# Altium project ECE453_DumptruckUltra_Board.PrjPcb (part 1 of 4)
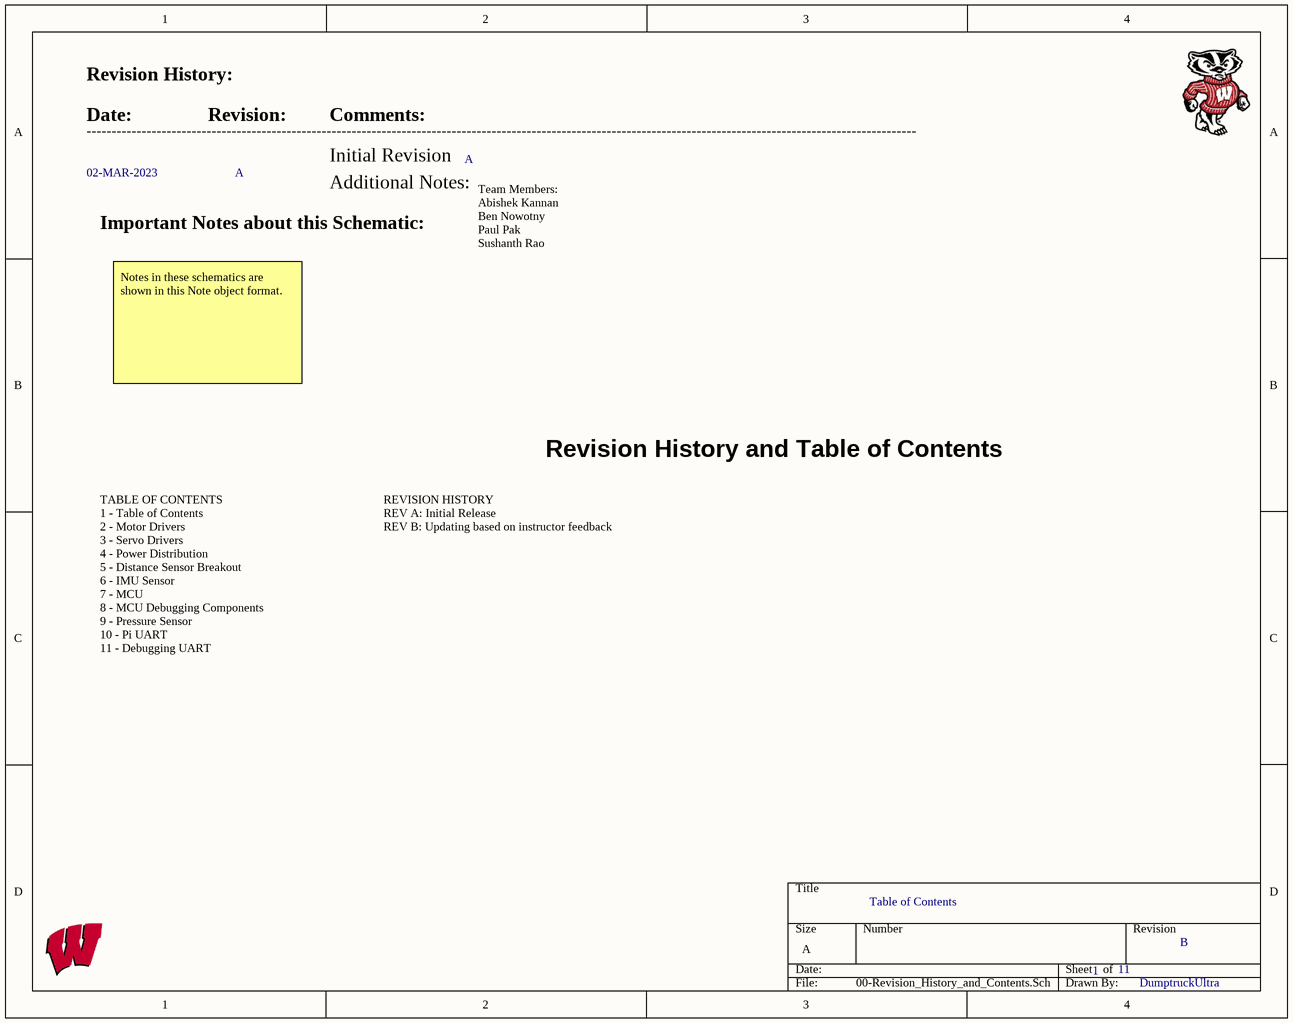
[diagram p0: 00-Revision_History_and_Contents.SchDoc]
11 sheets, 232 parts. Net scope: global (net labels, ports and power ports of the same name join across sheets).
Board file: MainBoard.PcbDoc
Sheets:
  00-Revision_History_and_Contents.SchDoc
  MotorDrivers.SchDoc
  ServoDrivers.SchDoc
  PowerDistribution.SchDoc
  DistanceSensor.SchDoc
  IMU.SchDoc
  MCU.SchDoc
  MCUDebug.SchDoc
  PressureSensor.SchDoc
  UART.SchDoc
  USB_to_UART.SchDoc

## Sheet 00-Revision_History_and_Contents.SchDoc: Revision History and Contents
size A; Date: 4/25/2017; ApprovedBy: JSK; CheckedBy: JSK; Author: JSK; CompanyName: University of Wisconsin; DrawnBy: JSK; Engineer: JSK; Organization: ECE 315; Address1: College of Engineering; Address2: 1415 Engineering Drive; Address3: Madison, WI 53706; Address4: ECE 453 Spring 2017; Revision: A; SheetNumber: 1; SheetTotal: 11

### Notes on the sheet
- Revision History:
- Date:
- ----------------------------------------------------------------------------------------------------------------------------------------------------------------------
- Revision:
- Comments:
- Initial Revision
- A
- 02-MAR-2023
- Important Notes about this Schematic:
- Additional Notes:
- Team Members:
  Abishek Kannan
  Ben Nowotny
  Paul Pak
  Sushanth Rao
- Notes in these schematics are shown in this Note object format.
- Revision History and Table of Contents
- TABLE OF CONTENTS
  1 - Table of Contents
  2 - Motor Drivers
  3 - Servo Drivers
  4 - Power Distribution
  5 - Distance Sensor Breakout
  6 - IMU Sensor
  7 - MCU
  8 - MCU Debugging Components
  9 - Pressure Sensor
  10 - Pi UART
  11 - Debugging UART
- REVISION HISTORY
  REV A: Initial Release
  REV B: Updating based on instructor feedback
- Table of Contents
- 1
- 11
- B
- DumptruckUltra

## Sheet MotorDrivers.SchDoc
size A; SheetNumber: 2; SheetTotal: 11
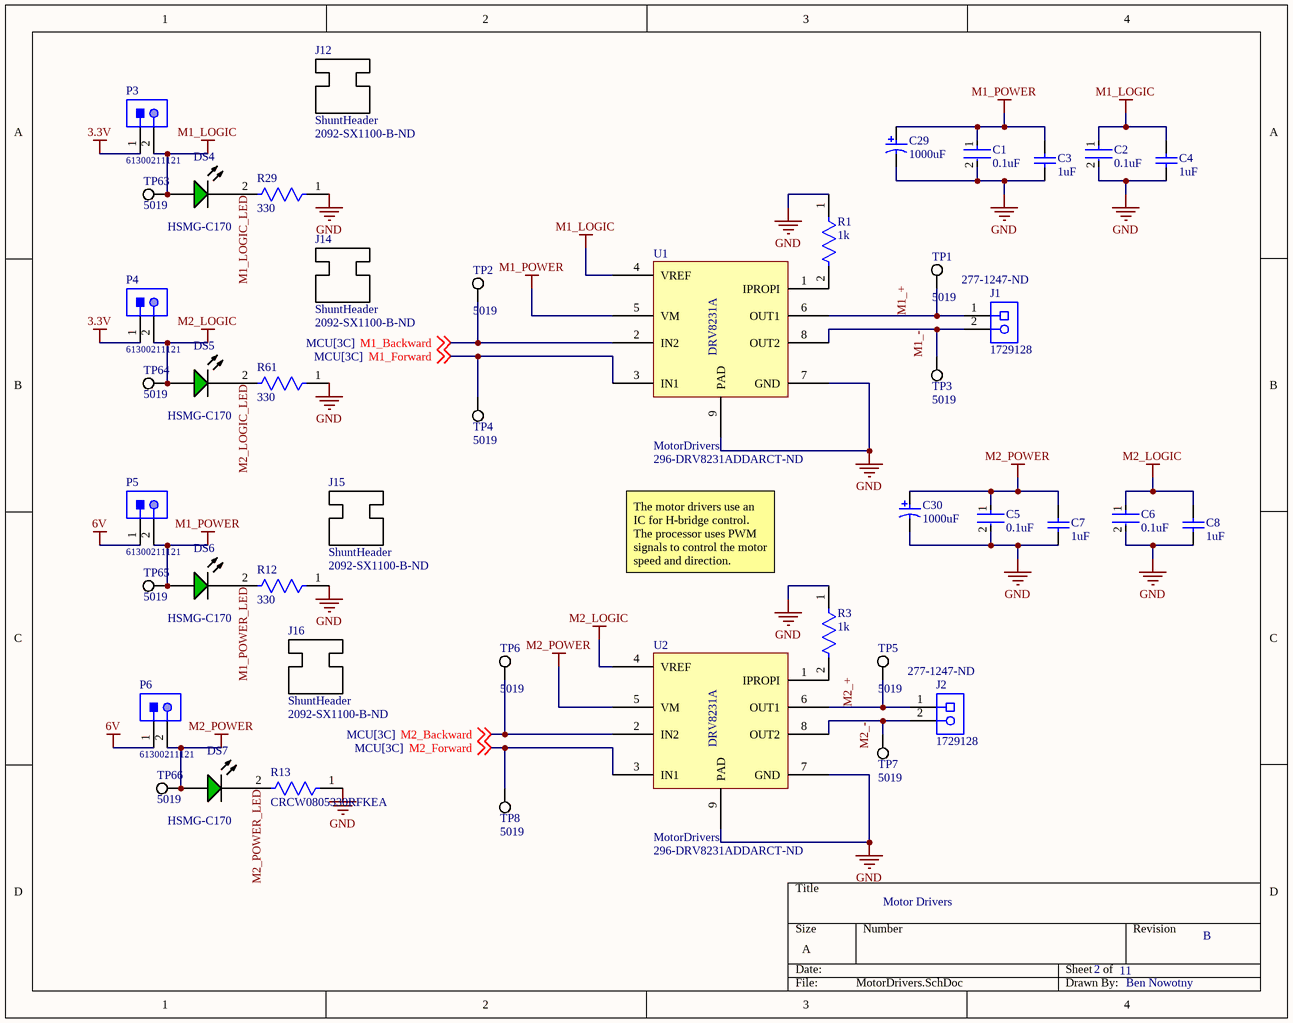
[diagram p1: MotorDrivers.SchDoc]

### Parts
C1  0.1uF  [FP-CC0805-0_85-MFG]
C2  0.1uF  [FP-CC0805-0_85-MFG]
C3  1uF  [CAPC2013X145X50ML20T25]
C4  1uF  [CAPC2013X145X50ML20T25]
C5  0.1uF  [FP-CC0805-0_85-MFG]
C6  0.1uF  [FP-CC0805-0_85-MFG]
C7  1uF  [CAPC2013X145X50ML20T25]
C8  1uF  [CAPC2013X145X50ML20T25]
C29  1000uF  [NIC-CAPA2-10X10_V]
C30  1000uF  [NIC-CAPA2-10X10_V]
DS4  HSMG-C170  [AVAG-HSMX-C170_V]
DS5  HSMG-C170  [AVAG-HSMX-C170_V]
DS6  HSMG-C170  [AVAG-HSMX-C170_V]
DS7  HSMG-C170  [AVAG-HSMX-C170_V]
J1  1729128  Supplier Part Number 1: 277-1247-ND  [PHOE-1729128-2_V]
J2  1729128  Supplier Part Number 1: 277-1247-ND  [PHOE-1729128-2_V]
J12  ShuntHeader  Supplier Part Number 1: 2092-SX1100-B-ND
J14  ShuntHeader  Supplier Part Number 1: 2092-SX1100-B-ND
J15  ShuntHeader  Supplier Part Number 1: 2092-SX1100-B-ND
J16  ShuntHeader  Supplier Part Number 1: 2092-SX1100-B-ND
P3  61300211121  [61300211121]
P4  61300211121  [61300211121]
P5  61300211121  [61300211121]
P6  61300211121  [61300211121]
R1  1k  [FP-ERA6A-IPC_C]
R3  1k  [FP-ERA6A-IPC_C]
R12  330  [FP-CRCW0805-e3-MFG]
R13  CRCW0805330RFKEA  [FP-CRCW0805-e3-MFG]
R29  330  [FP-CRCW0805-e3-MFG]
R61  330  [FP-CRCW0805-e3-MFG]
TP1  5019  [KSTN-5019_V]
TP2  5019  [KSTN-5019_V]
TP3  5019  [KSTN-5019_V]
TP4  5019  [KSTN-5019_V]
TP5  5019  [KSTN-5019_V]
TP6  5019  [KSTN-5019_V]
TP7  5019  [KSTN-5019_V]
TP8  5019  [KSTN-5019_V]
TP63  5019  [KSTN-5019_V]
TP64  5019  [KSTN-5019_V]
TP65  5019  [KSTN-5019_V]
TP66  5019  [KSTN-5019_V]
U1  MotorDrivers  Supplier Part Number 1: 296-DRV8231ADDARCT-ND  [SOIC127P600X170_HS-9N]
U2  MotorDrivers  Supplier Part Number 1: 296-DRV8231ADDARCT-ND  [SOIC127P600X170_HS-9N]

### Nets
3.3V: P3.1 P4.1  [project net RGBLED_R]
6V: P5.1 P6.1
GND: C1.2 C2.2 C3.1 C4.1 C5.2 C6.2 C7.1 C8.1 C29.2 C30.2 R1.1 R3.1 R12.1 R13.1 R29.1 R61.1 U1.7(GND) U1.9(PAD) U2.7(GND) U2.9(PAD)
M1_LOGIC: C2.1 C4.2 DS4.1(A) P3.2 TP63.1 U1.4(VREF)
M1_POWER: C1.1 C3.2 C29.1 DS6.1(A) P5.2 TP65.1 U1.5(VM)
M2_LOGIC: C6.1 C8.2 DS5.1(A) P4.2 TP64.1 U2.4(VREF)
M2_POWER: C5.1 C7.2 C30.1 DS7.1(A) P6.2 TP66.1 U2.5(VM)
M1_+: J1.1 TP1.1 U1.6(OUT1)
M1_-: J1.2 TP3.1 U1.8(OUT2)
M1_Backward: TP2.1 U1.2(IN2) ; off-sheet M1_Backward
M1_Forward: TP4.1 U1.3(IN1) ; off-sheet M1_Forward
M1_LOGIC_LED: DS4.2(K) R29.2
M1_POWER_LED: DS6.2(K) R12.2
M2_+: J2.1 TP5.1 U2.6(OUT1)
M2_-: J2.2 TP7.1 U2.8(OUT2)
M2_Backward: TP6.1 U2.2(IN2) ; off-sheet M2_Backward
M2_Forward: TP8.1 U2.3(IN1) ; off-sheet M2_Forward
M2_LOGIC_LED: DS5.2(K) R61.2
M2_POWER_LED: DS7.2(K) R13.2
NetR1_2: R1.2 U1.1(IPROPI)
NetR3_2: R3.2 U2.1(IPROPI)

### Notes on the sheet
- The motor drivers use an IC for H-bridge control.  The processor uses PWM signals to control the motor speed and direction.
- Motor Drivers
- 11
- B
- Ben Nowotny
- (in symbol MotorDrivers) DRV8231A

### Library data of the parts
C1 C2 C5 C6 = CMP-1036-04410-2: CAP CER 0.1UF 25V X7R 0805; Manufacturer Part Number: CC0805KRX7R8BB104; Manufacturer: Yageo; Tolerance: 0.1; Material: Ceramic; Value: 100 nF; Insulation Resistance: 100GR; ComponentLink2URL: http://www.yageo.com/documents/recent/UPY-GPHC_Y5V_6.3V-to-50V_8.pdf; Category: Cap; Mouser Description: Multilayer Ceramic Capacitors MLCC - SMD/SMT 100nF 25V X7R 10%; Device Class L1: Passive Components; Footprint Url: http://www.yageo.com/exep/pages/download/literatures/UPY-C_GEN_24.pdf; Height: 0.95mm; Digikey Description: CAP CER 0.1UF 25V X7R 0805; Lead Free: Yes; Temperature Range High: +85°C; Temperature: -30°C to +85°C; Ipc Land Pattern Name: CAPC200125X85; Capacitance: 100 nF; Automotive: No; Octopart: https://octopart.com/cc0805krx7r8bb104-yageo-39467766; Device Class L2: Capacitors; Temperature Characteristic: X7R; Voltage Rating: 25 V; ComponentLink2Description: Datasheet; Temperature Range Low: -30°C; Device Class L3: Ceramic Capacitors; RoHS: TRUE; Package: CC0805-0.85; Supplier 1: Digi-Key; Supplier Part Number 1: 311-1141-1-ND; Stock 1: 1013369; Pricing 1: 1=0.11000, 10=0.07700, 50=0.04380, 100=0.03620, 500=0.02542, 1000=0.02104 (USD); Mount: Surface Mount; Case/Package: 0805; Number of Pins: 2; Case Code (Metric): 2012; Case Code (Imperial): 0805; Min Operating Temperature: -55°C; Max Operating Temperature: 125°C; Packaging: Tape and Reel; Voltage Rating (DC): 25V; Dielectric: X7R; Package Quantity: 4000; Termination: SMD/SMT; Series: CC; Resistor Type: Ceramic; Length: 2mm; Width: 1.25mm; Depth: 1.25mm; Thickness: 0.033inch; Radiation Hardening: No; RoHS Compliant: Yes; Reach SVHC Compliant: Yes; Halogen Free: Halogen Free; ComponentLink1URL: https://datasheet.ciiva.com/8034/70765-8034031.pdf?src-supplier=Element14; ComponentLink1Description: https://datasheet.ciiva.com/8034/70765-8034031.pdf?src-supplier=Element14; ComponentLink3URL: https://datasheet.ciiva.com/28450/1489800-28450789.pdf?src-supplier=Element14; ComponentLink3Description: https://datasheet.ciiva.com/28450/1489800-28450789.pdf?src-supplier=Element14; ComponentLink4URL: https://datasheet.ciiva.com/46430/1850775-46430166.pdf?src-supplier=Element14; ComponentLink4Description: https://datasheet.ciiva.com/46430/1850775-46430166.pdf?src-supplier=Element14; ComponentLink5URL: https://datasheet.ciiva.com/145/mlccorderingcode-145008.pdf?src-supplier=Digi-Key; ComponentLink5Description: https://datasheet.ciiva.com/145/mlccorderingcode-145008.pdf?src-supplier=Digi-Key; ComponentLink6URL: https://datasheet.ciiva.com/145/mlccorderingcode-145007.pdf?src-supplier=Digi-Key; ComponentLink6Description: https://datasheet.ciiva.com/145/mlccorderingcode-145007.pdf?src-supplier=Digi-Key; ComponentLink7URL: https://datasheet.ciiva.com/145/mlccorderingcode-145009.pdf?src-supplier=Digi-Key; ComponentLink7Description: https://datasheet.ciiva.com/145/mlccorderingcode-145009.pdf?src-supplier=Digi-Key; ComponentLink8URL: https://datasheet.ciiva.com/8034/1784427-8034030.pdf?src-supplier=Element14; ComponentLink8Description: https://datasheet.ciiva.com/8034/1784427-8034030.pdf?src-supplier=Element14
C3 C4 C7 C8 = CMP-1036-04757-2: Part Number: CC0805ZRY5V8BB105; Manufacturer: Yageo; Voltage Rating: 25V; Tolerance: 80%; Dielectric: Y5V; Supplier 1: Digi-Key; Supplier Part Number 1: 311-1358-1-ND; Manufacturer Part Number: CC0805ZRY5V8BB105; RoHS: Yes; Category: Ceramic Capacitors; Stock 1: 286163; Pricing 1: 1=0.13000, 10=0.09000, 50=0.05100, 100=0.04230, 500=0.02966, 1000=0.02456 (USD); Mount: Surface Mount; Case/Package: 0805; Case Code (Metric): 2012; Case Code (Imperial): 0805; Weight: 0.000194oz; Min Operating Temperature: -30°C; Max Operating Temperature: 85°C; Package Quantity: 1; Capacitance: 1uF; Packaging: Tape and Reel; Voltage Rating (DC): 25V; Termination: SMD/SMT; Series: CC; Resistor Type: Ceramic; Length: 2mm; Width: 1.25mm; Height: 0.85mm; Thickness: 0.033inch; Depth: 1.25mm; Radiation Hardening: No; RoHS Compliant: Yes; Reach SVHC Compliant: Yes; Lead Free: Lead Free; Halogen Free: Halogen Free; ComponentLink1URL: https://datasheet.ciiva.com/144/mlccorderingcode-144703.pdf?src-supplier=Digi-Key; ComponentLink1Description: https://datasheet.ciiva.com/144/mlccorderingcode-144703.pdf?src-supplier=Digi-Key; ComponentLink2URL: https://datasheet.ciiva.com/26863/getdatasheetpartid-419810-26863011.pdf?src-supplier=Verical; ComponentLink2Description: https://datasheet.ciiva.com/26863/getdatasheetpartid-419810-26863011.pdf?src-supplier=Verical; ComponentLink3URL: https://datasheet.ciiva.com/28450/1132289-28450860.pdf?src-supplier=Element14; ComponentLink3Description: https://datasheet.ciiva.com/28450/1132289-28450860.pdf?src-supplier=Element14; ComponentLink4URL: https://datasheet.ciiva.com/144/mlccorderingcode-144704.pdf?src-supplier=Digi-Key; ComponentLink4Description: https://datasheet.ciiva.com/144/mlccorderingcode-144704.pdf?src-supplier=Digi-Key; ComponentLink5URL: https://datasheet.ciiva.com/144/mlccorderingcode-144705.pdf?src-supplier=Digi-Key; ComponentLink5Description: https://datasheet.ciiva.com/144/mlccorderingcode-144705.pdf?src-supplier=Digi-Key; ComponentLink6URL: https://datasheet.ciiva.com/13208/upy-gp-np0-16v-to-50v-8-13208251.pdf?src-supplier=Mouser; ComponentLink6Description: https://datasheet.ciiva.com/13208/upy-gp-np0-16v-to-50v-8-13208251.pdf?src-supplier=Mouser
C29 C30 = CMP-0687-00006-1: Aluminum Electrolytic Capacitor, UD Series, Low Impedance, 1000 uF, 10 V, + / - 20%, -55 to 105 degC, Chip Type, 10 x 10 mm D x L, Pb-Free, Reel; Manufacturer: Nichicon; PartNumber: UUD1A102MNL1GS; Rated Voltage: 10 V; Endurance Time: 5000 h; Impedance: 0.09 Ohm; Packing: Dia382mm Reel; Tolerance Rated Capacitance: -20 to 20%; Rated Ripple Current (at 100kHz): 670 mA; Dielectric Material: Aluminium; Voltage Rating (DC): 10V; Value: 1mF; Ripple Current: 670mA; Leakage Current: 3uA; Life (Hours): 5000Hour; Dissipation Factor: 0.24%; Lead Diameter: 1.1mm; DatasheetVersion: 08/2012; PackageReference: CAPAE-D10H10; PackageDescription: 2-Pin Surface Mount Device, Diameter 10 mm, Height 10 mm, Pitch 8 mm; ComponentLink3URL: http://products.nichicon.co.jp/en/pdf/XJA043/e-ud.pdf; ComponentLink2Description: Datasheet; Diameter: 10 mm; ComponentLink1Description: Manufacturer URL; RoHS: TRUE; ComponentLink2URL: http://products.nichicon.co.jp/en/pdf/XJA043/e-ud.pdf; Length: 10 mm; Rated Capacitance: 1000 uF; ComponentLink1URL: http://www.nichicon.co.jp/; Mounting Technology: Surface Mount; ComponentLink3Description: Package Specification; Supplier 1: Digi-Key; Supplier Part Number 1: 493-2254-1-ND; Manufacturer Part Number: UUD1A102MNL1GS; Category: Aluminum Electrolytic Capacitors; Stock 1: 3265; Pricing 1: 1=0.94000, 10=0.69100, 50=0.55260, 100=0.47360 (USD); Case/Package: Radial; Pins: 2; Min Operating Temperature: -55°C; Max Operating Temperature: 105°C; Tolerance: 20%; Package Quantity: 1; Packaging: Tape and Reel; Voltage Rating: 10V; Termination: SMD/SMT; Voltage: 10V; Series: UD; Construction: Cylindrical; Ripple Current (AC): 670mA; Height: 10mm; Height - Seated (Max): 0.394inch; Lead Pitch: 4.5mm; Radiation Hardening: No; Reach SVHC Compliant: Yes; RoHS Compliant: Yes; Lead Free: Lead Free; ComponentLink4URL: https://datasheet.ciiva.com/11781/0900766b80fa39e7-11781903.pdf?src-supplier=Rs; ComponentLink4Description: https://datasheet.ciiva.com/11781/0900766b80fa39e7-11781903.pdf?src-supplier=Rs; ComponentLink5URL: https://datasheet.ciiva.com/98/e-ud-98263.pdf?src-supplier=Digi-Key; ComponentLink5Description: https://datasheet.ciiva.com/98/e-ud-98263.pdf?src-supplier=Digi-Key; ComponentLink6URL: https://datasheet.ciiva.com/98/e-ud-98264.pdf?src-supplier=Digi-Key; ComponentLink6Description: https://datasheet.ciiva.com/98/e-ud-98264.pdf?src-supplier=Digi-Key; ComponentLink7URL: https://datasheet.ciiva.com/98/e-ud-98265.pdf?src-supplier=Digi-Key; ComponentLink7Description: https://datasheet.ciiva.com/98/e-ud-98265.pdf?src-supplier=Digi-Key; ComponentLink8URL: https://datasheet.ciiva.com/16502/e-ud-16502759.pdf?src-supplier=Future+Electronics; ComponentLink8Description: https://datasheet.ciiva.com/16502/e-ud-16502759.pdf?src-supplier=Future+Electronics; ComponentLink9URL: https://datasheet.ciiva.com/7793/66055-7793131.pdf?src-supplier=Element14; ComponentLink9Description: https://datasheet.ciiva.com/7793/66055-7793131.pdf?src-supplier=Element14; ComponentLink10URL: https://datasheet.ciiva.com/28458/e-ud-28458024.pdf?src-supplier=Element14; ComponentLink10Description: https://datasheet.ciiva.com/28458/e-ud-28458024.pdf?src-supplier=Element14; ComponentLink11URL: https://datasheet.ciiva.com/22693/66055-22693549.pdf?src-supplier=Element14; ComponentLink11Description: https://datasheet.ciiva.com/22693/66055-22693549.pdf?src-supplier=Element14
DS4-DS7 = CMP-2000-05062-1: Chip LED, Green, 2.2 V, -40 to 85 degC, 2-Pin SMD, Pb-Free, Tape and Reel; Manufacturer: Avago; No. of Pins: 2; Peak Wavelength: 570nm; SVHC: NoSVHC(16-Jun-2014); Dominant Wavelength: 572nm; Forward Current If: 20mA; Viewing Angle: 170deg; Lens Shape: Rectangular; PIV Max: 5V; External Width: 1.25mm; LED Type: Standard; External Depth: 0.8mm; Opto Mounting Orientation: Top; Luminous Intensity: 15mcd; Luminous Intensity Min: 4mcd; Forward Voltage VF Max: 2.6V; External Length / Height: 2mm; Bulb Size: 1.25mmx1.4mm; Light Area Height: 1mm; Voltage Vf Typ: 2.2V; Operating Temperature Max: 85degC; Datasheet Version: Oct-08; MSL: MSL2A-4weeks; Peak Forward Current: 20mA; Package Description: 2-Pin Surface Mount Device, Body 2 x 1.25 mm, Height 0.8 mm; Datasheet URL: https://datasheet.ciiva.com/29280/180495-da-01-en-chip-led-hsmg-c170-gelb-gruen-29280971.pdf; Storage Temperature Min: -40degC; LED Colour: Green; Wavelength Typ: 570nm; Mounting Type: SMD; Forward Current If Max: 20mA; Dominant Wavelength Typ: 572nm; LED Mounting: SMD; Operating Temperature Range: -30degCto+85degC; Operating Temperature Min: -30degC; Manufacturer URL: http://www.avagotech.com/; Packaging: CutTape; Luminous Intensity Typ: 15mcd; Package Reference: HSMX-C170; Storage Temperature Max: 85degC; Opto Case Style: SMD; Forward Voltage: 2.2V
J1 J2 = CMP-2000-05815-1: PCB Terminal Block, 13.5 A, 400 V, 2-Pin THD, RoHS, Bulk; Manufacturer: Phoenix Contact; Package Version: 03/2015; No. of Rows: 1; Pitch: 5.08mm; No. of Positions: 2; Voltage Rating: 400V; Current Rating: 13500mA; Current: 10A; Voltage: 300V; Connector Type: Screw; Max Current Rating: 13.5A; Test Voltage: 4kV; Wire Gauge (Max): 26AWG; Wire Gauge (Min): 14AWG; Approvals: UL,CSA; Manufacturer URL: http://www.phoenixcontact.com/; Datasheet URL: https://datasheet.ciiva.com/16046/1729128-16046181.pdf; RoHS: TRUE; Package URL: https://www.phoenixcontact.com/online/portal/pi/pxc/product_detail_page/!ut/p/b1/3VdJjqNKFDxLH8AFycySyWY2ozFsEPOMMQaDOX1XedGL_1Vdm5YXJleknhSKeBkvI6EA8ncAo3AYoDhBQGco6KN7VURTdemj9us_IEKEZo_YHiPAEWEFmDGOHMORkqKYCORBZxgL7ZoaZYcbFFUZ3fqxSY6GOuxydWUuHqz1ynmMFygu583Bob0Ewr6Sd_l-5m-kAueHiB0jpRwZwe58wwtkpxtMYd_LmGcDRU02dRNEyWt6Y2ti5pSyJ_reIkzIulrqApdnbT11V5jnCKbYNCvhEM1MCpPByat_X379-iThf08CI5GfOPqfBeS3BRoBOdD55AKVv0iLwCMq-2BrzXWSGRH7pUGD9uwXQjiph3xL0DKQwdGa0JImiIOmBNOestqgwTHSSs2oOep-78apyXQBvNi8ZLaFjvjWvcaUEBu0MC6Wbe-d6mB0FAebo2lUWinqYaZs5DAYzV0RP9yitUjnGJ0iI9xhZkT42OCQNUJJhkgWINNQLP2JFP6OpMg3JCVg70jqHT0lvKOnhHf0lPuOnnLf0VPuWx6_dxwUIvwk5WMkT0kLL1mh61l2yZVSzG3pYV_bqo-mj6uMKwKwdnnW8Jh5RTOJzMOA5c-eJDaZQw4mTMPH02PvS_ZAqNVjVTo2WyYLkwH_KU1mmmG5kjRhDqPXLwwVHvVOjCM60-fpXvTDfMGW1PVFVS1r4e4yVDk4ZdNbkUHvqPqQSeian4UD39fNKmachqdJ1NJbyk8rXT9mXTvPk3oE5meulKGgiruPJek-4I9hTT6G8ZLOyRSm2RRVbThERQad5OS28hdt4YW4vG0stgYYzsWsK4_7y6DZMjJSCqri1kyiZR5vD7pwIrNR7QwPHTcLTI5qT7eRlpHrdGiupYlqQDJ7zy_CND8fWWBoLRXxk1RVcXiBQwbTD4Xi7KL-FuO94t9xaqweXzH; PartNumber: 1729128; Package Description: 2-Pin Through Hole Device, Body 8.1 x 10.16 mm, Pitch 5.08 mm; Datasheet Version: 12/2013; Mounting Technology: ThroughHole; Orientation: Horizontal; Package Reference: 1729128-2; Packing: Bulk; Supplier 1: Digi-Key; Manufacturer Part Number: 1729128; Category: Terminal Blocks; Stock 1: 23221; Pricing 1: 1=1.32000, 10=1.16200, 50=1.11100, 100=1.08070, 250=1.01000, 500=0.92920, 1000=0.85850, 2500=0.81810, 5000=0.76760 (USD); Pins: 2; Color: Green; Housing Material: Polyamide; Contact Material: Tin; Housing Color: Green; Insulation Material: Nylon; Weight: 0.069842oz; Min Operating Temperature: -20°C; Max Operating Temperature: 100°C; Package Quantity: 50; Packaging: Bulk; Termination: Solder; Number of Positions: 2; Series: MKDSN; Number of Poles: 2; Number of Levels: 1; Number of Positions Per Level: 2; Number of Contacts: 2; Number of Rows: 1; Number of Circuits: 2; Max Supply Voltage: 400V; Length: 8.1mm; Width: 13.5mm; Height: 13.5mm; Wire/Cable Gauge: 26AWG; Depth: 8.1mm; Radiation Hardening: No; RoHS Compliant: Yes; Lead Free: Lead Free; Flammability Rating: UL94 V-0; Reach SVHC Compliant: Yes; ComponentLink1URL: https://datasheet.ciiva.com/16046/1729128-16046181.pdf?src-supplier=Onlinecomponents.com; ComponentLink1Description: https://datasheet.ciiva.com/16046/1729128-16046181.pdf?src-supplier=Onlinecomponents.com; ComponentLink2URL: https://datasheet.ciiva.com/15169/getdatasheetpartid-199310-15169845.pdf?src-supplier=Verical; ComponentLink2Description: https://datasheet.ciiva.com/15169/getdatasheetpartid-199310-15169845.pdf?src-supplier=Verical; ComponentLink3URL: https://datasheet.ciiva.com/823/1729128-823779.pdf?src-supplier=Digi-Key; ComponentLink3Description: https://datasheet.ciiva.com/823/1729128-823779.pdf?src-supplier=Digi-Key; ComponentLink4URL: https://datasheet.ciiva.com/14607/70054405-14607157.pdf?src-supplier=Allied+Electronics; ComponentLink4Description: https://datasheet.ciiva.com/14607/70054405-14607157.pdf?src-supplier=Allied+Electronics; ComponentLink5URL: https://datasheet.ciiva.com/29218/743664-da-01-en-printklemmenblock-mkdsn-1-5-2-5-08-29218154.pdf?src-supplier=Conrad; ComponentLink5Description: https://datasheet.ciiva.com/29218/743664-da-01-en-printklemmenblock-mkdsn-1-5-2-5-08-29218154.pdf?src-supplier=Conrad
J12 J14-J16 = ShuntHeader: Conn Mini Shunt 2 POS 2.54mm Black Cable Mount; Manufacturer: Kycon; Manufacturer Part Number: SX1100-B; Current Rating: 3A; Number of Positions: 2; Insulation Resistance: 1GR; Supplier 1: Digi-Key; RoHS: Yes; Category: Headers and Wire Housings; Stock 1: 85316; Pricing 1: 1=0.10000, 10=0.06000, 25=0.04920, 50=0.04540, 100=0.04390, 250=0.03788, 500=0.03636, 1000=0.03182, 2500=0.02878 (USD); Contact Plating: Gold; Contact Material: Bronze; Housing Material: Thermoplastic; Min Operating Temperature: -55°C; Max Operating Temperature: 125°C; Number of Rows: 1; Contact Gender: Female; Packaging: Bulk; Pitch: 2.54mm; Flammability Rating: UL94 V-0; RoHS Compliant: Yes; ComponentLink1URL: http://www.mouser.com/ds/2/222/SX1100-B-461401.pdf?src-supplier=Mouser; ComponentLink1Description: http://www.mouser.com/ds/2/222/SX1100-B-461401.pdf?src-supplier=Mouser
P3-P6 = CMP-1712-00002-4: THT Vertical Pin Header WR-PHD, Pitch 2.54 mm, Single Row, 2 pins; Manufacturer: Wurth Elektronik; Rated Current: 3A; Gender: Male; Withstanding Voltage: 500VAC; Working Voltage: 250VAC; Pitch: 2.54mm; Contact Resistance: 20mOhm; Pin Number: 2; Voltage Rating: 250V; Connector Type: Male Pin; Mounting Technology: THT; Orientation: Vertical; Operating Temperature: -40to105degC; Packaging: Bag; Publisher: WurthElektronik; Datasheet URL: https://katalog.we-online.de/em/datasheet/6130xx11121.pdf; Manufacturer URL: http://www.we-online.de; Row Number: Single; Package Reference: 61300211121; Part Number: 61300211121; Supplier 1: Digi-Key; Supplier Part Number 1: 732-5315-ND; Manufacturer Part Number: 61300211121; RoHS: Yes; Category: Headers and Wire Housings; Stock 1: 204500; Pricing 1: 1=0.13000, 10=0.11300, 25=0.09400, 50=0.07900, 100=0.07100, 1000=0.06500 (USD); Contact Plating: Gold; Housing Material: PBT; Contact Material: Copper Alloy,Copper; Color: Black; Min Operating Temperature: -40°C; Max Operating Temperature: 125°C; Number of Rows: 1; Contact Gender: Male; Current Rating: 3A; Number of Positions: 2; Termination: Through Hole; Number of Contacts: 2; Series: WR-PHD; Contact Type: Male Pin; Contact Mating Length: 0.236inch; Lead Free: Lead Free; RoHS Compliant: Yes; ComponentLink1URL: https://datasheet.ciiva.com/13619/6130xx11121-48870-13619345.pdf?src-supplier=Mouser; ComponentLink1Description: https://datasheet.ciiva.com/13619/6130xx11121-48870-13619345.pdf?src-supplier=Mouser
R1 R3 = CMP-2001-00581-2: RES 1K OHM 0.1% 1/8W 0805; Temperature Coefficient: 25ppm/°C; Resistance: 1kR; Working Voltage: 100V; Max Power Dissipation: 125mW; Height: 0.5mm; Technology: THIN FILM; REACH SVHC: No SVHC; Packaging: Tape and Reel; Length: 2mm; Width: 1.25mm; Resistance Tolerance: 0.1%; Series: ERA-6A; Resistor Type: Thin Film; Number of Pins: 2; Case Code (Metric): 2012; Voltage Rating: 100V; Radiation Hardening: No; Construction: Rectangular; Mount: Surface Mount; Number of Terminations: 2; Case/Package: 0805; Min Operating Temperature: -55°C; Military Standard: Not; RoHS Compliant: Yes; Termination: SMD/SMT; Case Code (Imperial): 0805; Depth: 1.25mm; Power Rating: 125mW; Max Operating Temperature: 155°C; Contact Plating: Tin; Package Quantity: 5000; Tolerance: 0.1%
R12 R29 R61 = CMP-2001-03823-2: RES Thick Film, 330Ω, 1%, 0.125W, 100ppm/°C, 0805; Manufacturer: Vishay; Manufacturer Part Number: CRCW0805330RFKEA; Voltage Rating (DC): 150V; Resistance: 330R; Max Power Dissipation: 125mW; Mount: Surface Mount; Packaging: Tape and Reel; Min Operating Temperature: -55°C; Military Standard: Not; Case Code (Metric): 2012; Height: 0.02inch; Voltage Rating: 150V; Case/Package: 0805; Max Operating Temperature: 155°C; Width: 0.049inch; Case Code (Imperial): 0805; Termination: SMD/SMT; Lead Free: Lead Free; Contact Plating: Tin; Package Quantity: 10; Composition: Thick Film; Length: 2mm; Features: Automotive AEC-Q200; Depth: 1.25mm; Weight: 0.000194oz; Tolerance: 1%; Power Rating: 125mW; Number of Terminations: 2; Temperature Coefficient: 100ppm/°C; Supplier 1: Digi-Key; Supplier Part Number 1: 541-330CCT-ND; RoHS: Yes; Category: Chip SMD Resistors; Stock 1: 1889; Pricing 1: 1=0.10000, 10=0.06700, 100=0.02710, 1000=0.01219, 2500=0.01058 (USD); Size Code: 0805; Series: CRCW; Resistor Type: Thick Film; Construction: Rectangular; Resistance Tolerance: 1%; Ratings: AEC-Q200; RoHS Compliant: Yes; ComponentLink1URL: https://datasheet.ciiva.com/8944/dcrcwe3-8944773.pdf?src-supplier=Avnet; ComponentLink1Description: https://datasheet.ciiva.com/8944/dcrcwe3-8944773.pdf?src-supplier=Avnet; ComponentLink2URL: https://datasheet.ciiva.com/8944/dcrcwe3-8944776.pdf?src-supplier=Avnet; ComponentLink2Description: https://datasheet.ciiva.com/8944/dcrcwe3-8944776.pdf?src-supplier=Avnet; ComponentLink3URL: https://datasheet.ciiva.com/2495/dcrcwe3-2495803.pdf?src-supplier=Digi-Key; ComponentLink3Description: https://datasheet.ciiva.com/2495/dcrcwe3-2495803.pdf?src-supplier=Digi-Key; ComponentLink4URL: https://datasheet.ciiva.com/2495/dcrcwe3-2495804.pdf?src-supplier=Digi-Key; ComponentLink4Description: https://datasheet.ciiva.com/2495/dcrcwe3-2495804.pdf?src-supplier=Digi-Key; ComponentLink5URL: https://datasheet.ciiva.com/2495/dcrcwe3-2495805.pdf?src-supplier=Digi-Key; ComponentLink5Description: https://datasheet.ciiva.com/2495/dcrcwe3-2495805.pdf?src-supplier=Digi-Key; ComponentLink6URL: https://datasheet.ciiva.com/5545/dcrcwe3-109170-5545357.pdf?src-supplier=Mouser; ComponentLink6Description: https://datasheet.ciiva.com/5545/dcrcwe3-109170-5545357.pdf?src-supplier=Mouser; ComponentLink7URL: https://datasheet.ciiva.com/16769/70201119-16769852.pdf?src-supplier=Allied+Electronics; ComponentLink7Description: https://datasheet.ciiva.com/16769/70201119-16769852.pdf?src-supplier=Allied+Electronics; ComponentLink8URL: https://datasheet.ciiva.com/7777/1697337-7777390.pdf?src-supplier=Element14; ComponentLink8Description: https://datasheet.ciiva.com/7777/1697337-7777390.pdf?src-supplier=Element14; ComponentLink9URL: https://datasheet.ciiva.com/7777/1720486-7777573.pdf?src-supplier=Element14; ComponentLink9Description: https://datasheet.ciiva.com/7777/1720486-7777573.pdf?src-supplier=Element14
R13 = CMP-2001-03823-2: RES Thick Film, 330Ω, 1%, 0.125W, 100ppm/°C, 0805; Voltage Rating (DC): 150V; Resistance: 330R; Max Power Dissipation: 125mW; Mount: Surface Mount; Packaging: Tape and Reel; Min Operating Temperature: -55°C; Military Standard: Not; Case Code (Metric): 2012; Height: 0.02inch; Voltage Rating: 150V; Case/Package: 0805; Max Operating Temperature: 155°C; Width: 0.049inch; Case Code (Imperial): 0805; Termination: SMD/SMT; Lead Free: Lead Free; Contact Plating: Tin; Package Quantity: 10; Composition: Thick Film; Length: 2mm; Features: Automotive AEC-Q200; Depth: 1.25mm; Weight: 0.000194oz; Tolerance: 1%; Power Rating: 125mW; Number of Terminations: 2; Temperature Coefficient: 100ppm/°C
TP1-TP8 TP63-TP66 = CMP-1672-00008-1: Test Point, 1 Position SMD, RoHS, Tape and Reel; Manufacturer: Keystone Electronics; Body Material: Bronze; Plating: Silver; ComponentLink1Description: Manufacturer URL; Package Quantity: 1000; DatasheetVersion: 03/2014; Packaging: Tape and Reel; ComponentLink2URL: http://www.keyelco.com/product-pdf.cfm?p=1357; ComponentLink1URL: http://www.keyelco.com/; Mount: Surface Mount; Contact Plating: Silver; PackageDescription: 1-Pin Surface Mount Device, Body 3.81 x 2.03 mm; Pins: 1; RoHSCompliant: True; Mounting Technology: Surface Mount; ComponentLink2Description: Datasheet; PackageReference: 5019; Supplier 1: Digi-Key; Supplier Part Number 1: 36-5019CT-ND; Manufacturer Part Number: 5019; RoHS: Yes; Category: Connectors; Stock 1: 1009631; Pricing 1: 1=0.34000, 25=0.27360, 100=0.22340, 250=0.20064, 500=0.19152 (USD); Number of Pins: 1; Material: Bronze; Contact Material: Bronze; Series: 5019; Termination: SMD/SMT; Height: 0.09inch; RoHS Compliant: Yes; Reach SVHC Compliant: Yes; Lead Free: Lead Free; ComponentLink3URL: https://datasheet.ciiva.com/16885/70182998-16885945.pdf?src-supplier=Allied+Electronics; ComponentLink3Description: https://datasheet.ciiva.com/16885/70182998-16885945.pdf?src-supplier=Allied+Electronics; ComponentLink4URL: https://datasheet.ciiva.com/14848/m60-2p61-14848437.pdf?src-supplier=Digi-Key; ComponentLink4Description: https://datasheet.ciiva.com/14848/m60-2p61-14848437.pdf?src-supplier=Digi-Key; ComponentLink5URL: https://datasheet.ciiva.com/14848/m60-2p61-14848438.pdf?src-supplier=Digi-Key; ComponentLink5Description: https://datasheet.ciiva.com/14848/m60-2p61-14848438.pdf?src-supplier=Digi-Key; ComponentLink6URL: https://datasheet.ciiva.com/14848/m60-2p61-14848439.pdf?src-supplier=Digi-Key; ComponentLink6Description: https://datasheet.ciiva.com/14848/m60-2p61-14848439.pdf?src-supplier=Digi-Key; ComponentLink7URL: https://datasheet.ciiva.com/16318/m60-2p61-16318395.pdf?src-supplier=Future+Electronics; ComponentLink7Description: https://datasheet.ciiva.com/16318/m60-2p61-16318395.pdf?src-supplier=Future+Electronics
U1 U2 = MotorDrivers: 35-V, 3.7-A H-bridge motor driver with integrated current regulation & current-sense feedback 8-SO PowerPAD -40 to 150; Manufacturer: Texas Instruments; Manufacturer Part Number: DRV8231ADDAR; Supplier 1: Digi-Key; RoHS: No; Category: Integrated Circuits (ICs); Stock 1: 2557; Pricing 1: 1=2.00000, 10=1.79200, 25=1.69080, 100=1.44050, 250=1.35256, 500=1.18348, 1000=0.98061 (USD)

## Sheet ServoDrivers.SchDoc
size A; SheetNumber: 3; SheetTotal: 11
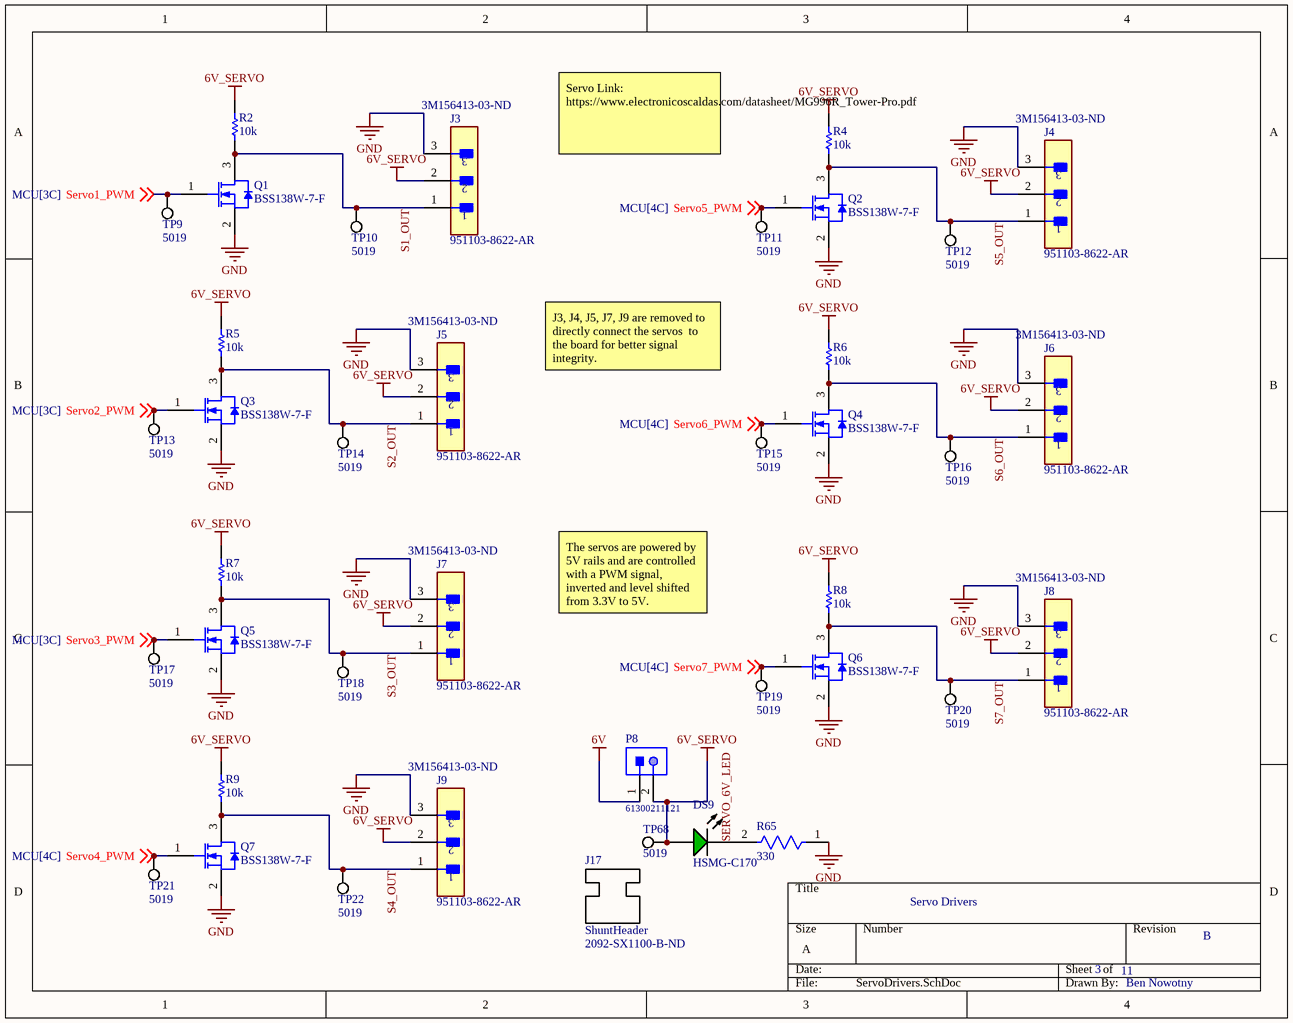
[diagram p2: ServoDrivers.SchDoc]

### Parts
DS9  HSMG-C170  [AVAG-HSMX-C170_V]
J3  951103-8622-AR  Supplier Part Number 1: 3M156413-03-ND  [FP-951103-8622-AR-MFG]
J4  951103-8622-AR  Supplier Part Number 1: 3M156413-03-ND  [FP-951103-8622-AR-MFG]
J5  951103-8622-AR  Supplier Part Number 1: 3M156413-03-ND  [FP-951103-8622-AR-MFG]
J6  951103-8622-AR  Supplier Part Number 1: 3M156413-03-ND  [FP-951103-8622-AR-MFG]
J7  951103-8622-AR  Supplier Part Number 1: 3M156413-03-ND  [FP-951103-8622-AR-MFG]
J8  951103-8622-AR  Supplier Part Number 1: 3M156413-03-ND  [FP-951103-8622-AR-MFG]
J9  951103-8622-AR  Supplier Part Number 1: 3M156413-03-ND  [FP-951103-8622-AR-MFG]
J17  ShuntHeader  Supplier Part Number 1: 2092-SX1100-B-ND
P8  61300211121  [61300211121]
Q1  BSS138W-7-F  [DIOD-SOT323-3_V]
Q2  BSS138W-7-F  [DIOD-SOT323-3_V]
Q3  BSS138W-7-F  [DIOD-SOT323-3_V]
Q4  BSS138W-7-F  [DIOD-SOT323-3_V]
Q5  BSS138W-7-F  [DIOD-SOT323-3_V]
Q6  BSS138W-7-F  [DIOD-SOT323-3_V]
Q7  BSS138W-7-F  [DIOD-SOT323-3_V]
R2  10k  [RESC2013X60X35NL10T20]
R4  10k  [RESC2013X60X35NL10T20]
R5  10k  [RESC2013X60X35NL10T20]
R6  10k  [RESC2013X60X35NL10T20]
R7  10k  [RESC2013X60X35NL10T20]
R8  10k  [RESC2013X60X35NL10T20]
R9  10k  [RESC2013X60X35NL10T20]
R65  330  [FP-CRCW0805-e3-MFG]
TP9  5019  [KSTN-5019_V]
TP10  5019  [KSTN-5019_V]
TP11  5019  [KSTN-5019_V]
TP12  5019  [KSTN-5019_V]
TP13  5019  [KSTN-5019_V]
TP14  5019  [KSTN-5019_V]
TP15  5019  [KSTN-5019_V]
TP16  5019  [KSTN-5019_V]
TP17  5019  [KSTN-5019_V]
TP18  5019  [KSTN-5019_V]
TP19  5019  [KSTN-5019_V]
TP20  5019  [KSTN-5019_V]
TP21  5019  [KSTN-5019_V]
TP22  5019  [KSTN-5019_V]
TP68  5019  [KSTN-5019_V]

### Nets
6V: P8.1
6V_SERVO: DS9.1(A) J3.2 J4.2 J5.2 J6.2 J7.2 J8.2 J9.2 P8.2 R2.2 R4.2 R5.2 R6.2 R7.2 R8.2 R9.2 TP68.1
GND: J3.3 J4.3 J5.3 J6.3 J7.3 J8.3 J9.3 Q1.2(S) Q2.2(S) Q3.2(S) Q4.2(S) Q5.2(S) Q6.2(S) Q7.2(S) R65.1
S1_OUT: J3.1 Q1.3(D) R2.1 TP10.1
S2_OUT: J5.1 Q3.3(D) R5.1 TP14.1
S3_OUT: J7.1 Q5.3(D) R7.1 TP18.1
S4_OUT: J9.1 Q7.3(D) R9.1 TP22.1
S5_OUT: J4.1 Q2.3(D) R4.1 TP12.1
S6_OUT: J6.1 Q4.3(D) R6.1 TP16.1
S7_OUT: J8.1 Q6.3(D) R8.1 TP20.1
Servo1_PWM: Q1.1(G) TP9.1 ; off-sheet Servo1_PWM
Servo2_PWM: Q3.1(G) TP13.1 ; off-sheet Servo2_PWM
Servo3_PWM: Q5.1(G) TP17.1 ; off-sheet Servo3_PWM
Servo4_PWM: Q7.1(G) TP21.1 ; off-sheet Servo4_PWM
Servo5_PWM: Q2.1(G) TP11.1 ; off-sheet Servo5_PWM
Servo6_PWM: Q4.1(G) TP15.1 ; off-sheet Servo6_PWM
Servo7_PWM: Q6.1(G) TP19.1 ; off-sheet Servo7_PWM
SERVO_6V_LED: DS9.2(K) R65.2

### Notes on the sheet
- Servo Link:
  https://www.electronicoscaldas.com/datasheet/MG996R_Tower-Pro.pdf
- J3, J4, J5, J7, J9 are removed to directly connect the servos  to the board for better signal integrity.
- The servos are powered by 5V rails and are controlled with a PWM signal, inverted and level shifted from 3.3V to 5V.
- Servo Drivers
- 11
- B
- Ben Nowotny

### Library data of the parts
DS9 = CMP-2000-05062-1: as DS4 on sheet MotorDrivers; Operating Temperature Max: 85degC; Datasheet Version: Oct-08; MSL: MSL2A-4weeks; Peak Forward Current: 20mA; Package Description: 2-Pin Surface Mount Device, Body 2 x 1.25 mm, Height 0.8 mm; Datasheet URL: https://datasheet.ciiva.com/29280/180495-da-01-en-chip-led-hsmg-c170-gelb-gruen-29280971.pdf; Storage Temperature Min: -40degC; LED Colour: Green; Wavelength Typ: 570nm; Mounting Type: SMD; Forward Current If Max: 20mA; Dominant Wavelength Typ: 572nm; LED Mounting: SMD; Operating Temperature Range: -30degCto+85degC; Operating Temperature Min: -30degC; Manufacturer URL: http://www.avagotech.com/; Packaging: CutTape; Luminous Intensity Typ: 15mcd; Package Reference: HSMX-C170; Storage Temperature Max: 85degC; Opto Case Style: SMD; Forward Voltage: 2.2V
J3-J9 = CMP-05379-000003-1: CONN HEADER VERT 3POS 2MM; Manufacturer: 3M; Conn Gender: Male; Current Rating: 2A; Number Of Contacts: 3; Conn Orientation: Straight; Voltage Rating: 1kV; Contact Resistance: 20mR; Max Current Rating: 1A; Contact Post Length: 2.8mm; Digikey Description: CONN HEADER VERT 3POS 2MM; Device Class L3: unset; Category: Conn; Height: 6.3mm; Manufacturer Part Number: 951103-8622-AR; RoHS: TRUE; Contact Material: Gold,Nickel; ComponentLink2Description: Datasheet; Temperature Range Low: -55°C; Device Class L1: Connectors; Pitch: 2mm; Mouser Description: Header; PinStrip; CopperAlloy; HighTempThermoplastic; 3Cnts; 1A; RtAngle; 951Series; Octopart: https://octopart.com/951103-8622-ar-3m-14400669; Package: 951103-8622-AR; Lead Free: Yes; Device Class L2: Headers and Wire Housings; Temperature Range High: +125°C; ComponentLink2URL: http://multimedia.3m.com/mws/media/1400506O/3m-pin-strip-header-951-series-78-5100-2653-3.pdf; Automotive: No; Temperature: -55°C to +125°C; Number Of Rows: 1; Supplier 1: Digi-Key; Stock 1: 1012; Pricing 1: 1=0.30000, 10=0.28800, 25=0.24720, 50=0.21020, 100=0.20190, 250=0.18128, 500=0.17304 (USD); Mounting Technology: Through Hole; Color: Black; Contact Plating: Gold; Housing Material: Thermoplastic; Contact Finish - Mating: GOLD; Contact Shape: Square; Insulation Material: Thermoplastic; Insulation Color: Black; Housing Color: Black; Min Operating Temperature: -55°C; Max Operating Temperature: 125°C; Packaging: Bulk; Number of Positions: 3; Termination: Solder; Connector Type: Header; Series: 951; Contact Type: Male Pin; Package Quantity: 3000; Fastening Type: Pull; Contact Gender: Male; Gender: Male; Orientation: Straight; Length: 6mm; Contact Mating Length: 0.173inch; Depth: 2mm; RoHS Compliant: Yes; Flammability Rating: UL94 V-0; ComponentLink1URL: https://datasheet.ciiva.com/730/ts2156-730432.pdf?src-supplier=Digi-Key; ComponentLink1Description: https://datasheet.ciiva.com/730/ts2156-730432.pdf?src-supplier=Digi-Key; ComponentLink3URL: https://datasheet.ciiva.com/14622/70237750-14622743.pdf?src-supplier=Allied+Electronics; ComponentLink3Description: https://datasheet.ciiva.com/14622/70237750-14622743.pdf?src-supplier=Allied+Electronics; ComponentLink4URL: https://datasheet.ciiva.com/7997/ts2156-7997244.pdf?src-supplier=Element14; ComponentLink4Description: https://datasheet.ciiva.com/7997/ts2156-7997244.pdf?src-supplier=Element14
J17 = ShuntHeader: as J12 on sheet MotorDrivers; Supplier 1: Digi-Key; RoHS: Yes; Category: Headers and Wire Housings; Stock 1: 85316; Pricing 1: 1=0.10000, 10=0.06000, 25=0.04920, 50=0.04540, 100=0.04390, 250=0.03788, 500=0.03636, 1000=0.03182, 2500=0.02878 (USD); Contact Plating: Gold; Contact Material: Bronze; Housing Material: Thermoplastic; Min Operating Temperature: -55°C; Max Operating Temperature: 125°C; Number of Rows: 1; Contact Gender: Female; Packaging: Bulk; Pitch: 2.54mm; Flammability Rating: UL94 V-0; RoHS Compliant: Yes; ComponentLink1URL: http://www.mouser.com/ds/2/222/SX1100-B-461401.pdf?src-supplier=Mouser; ComponentLink1Description: http://www.mouser.com/ds/2/222/SX1100-B-461401.pdf?src-supplier=Mouser
P8 = CMP-1712-00002-4: as P3 on sheet MotorDrivers; Mounting Technology: THT; Orientation: Vertical; Operating Temperature: -40to105degC; Packaging: Bag; Publisher: WurthElektronik; Datasheet URL: https://katalog.we-online.de/em/datasheet/6130xx11121.pdf; Manufacturer URL: http://www.we-online.de; Row Number: Single; Package Reference: 61300211121; Part Number: 61300211121; Supplier 1: Digi-Key; Supplier Part Number 1: 732-5315-ND; Manufacturer Part Number: 61300211121; RoHS: Yes; Category: Headers and Wire Housings; Stock 1: 204500; Pricing 1: 1=0.13000, 10=0.11300, 25=0.09400, 50=0.07900, 100=0.07100, 1000=0.06500 (USD); Contact Plating: Gold; Housing Material: PBT; Contact Material: Copper Alloy,Copper; Color: Black; Min Operating Temperature: -40°C; Max Operating Temperature: 125°C; Number of Rows: 1; Contact Gender: Male; Current Rating: 3A; Number of Positions: 2; Termination: Through Hole; Number of Contacts: 2; Series: WR-PHD; Contact Type: Male Pin; Contact Mating Length: 0.236inch; Lead Free: Lead Free; RoHS Compliant: Yes; ComponentLink1URL: https://datasheet.ciiva.com/13619/6130xx11121-48870-13619345.pdf?src-supplier=Mouser; ComponentLink1Description: https://datasheet.ciiva.com/13619/6130xx11121-48870-13619345.pdf?src-supplier=Mouser
Q1-Q7 = CMP-2000-05968-1: N-Channel Enhancement Mode Mosfet, 50 V, 200 mA, -55 to 150 degC, 6-Pin SOT-323, RoHS, Tape and Reel; Typical Turn-Off Delay Time: 20ns; Number of Channels: 1Channel; Type: EnhancementModeFieldEffectTransistor; Brand: DiodesIncorporated; Vds - Drain-Source Breakdown Voltage: 75V; Vgs - Gate-Source Voltage: 20V; Rds On - Drain-Source Resistance: 1.4Ohms; Transistor Type: 1N-Channel; Configuration: Single; Unit Weight: 0.000212oz; Pd - Power Dissipation: 200mW; Id - Continuous Drain Current: 200mA; Forward Transconductance - Min: 0.1S; Rds On Max: 3.5R; Drain to Source Voltage (Vdss): 50V; Threshold Voltage: 1.2V; Input Capacitance: 50pF; Drain to Source Resistance: 1.4R; Number of Elements: 1; Manufacturer URL: http://www.diodes.com/; Series: BSS138; Package Description: 3-Pin Small Outline Transistor, Body 2 x 1.25 mm, Pitch 0.65 mm; Mounting Technology: SurfaceMount; Product Category: MOSFET; RoHS: True; Maximum Operating Temperature: +150C; Height: 1mm; Length: 2.2mm; Technology: Si; Width: 1.35mm; Datasheet URL: http://www.diodes.com/_files/datasheets/ds30206.pdf; Manufacturer: DiodesIncorporated; Package / Case: SOT-323-3; Typical Turn-On Delay Time: 20ns; Transistor Polarity: N-Channel; Factory Pack Quantity: 3000; Packaging: Reel; Product: MOSFETSmallSignal; Datasheet Version: Rev. 11-2, 09/2013; Package Reference: SOT323; Minimum Operating Temperature: -55C; Mounting Style: SMD/SMT; Channel Mode: Enhancement; Supplier 1: Digi-Key; Supplier Part Number 1: BSS138W-FDICT-ND; Manufacturer Part Number: BSS138W-7-F; Category: MOSFETs; Stock 1: 346188; Pricing 1: 1=0.31000, 10=0.25600, 100=0.13590, 500=0.08938, 1000=0.06078 (USD); Case/Package: SOT-323; Pins: 3; Weight: 0.000212oz; Contact Plating: Tin,Matte; Min Operating Temperature: -55°C; Max Operating Temperature: 150°C; Max Power Dissipation: 200mW; Continuous Drain Current (ID): 200mA; Power Dissipation: 200mW; Nominal Vgs: 1.2V; Package Quantity: 1; Drain to Source Breakdown Voltage: 75V; Turn-Off Delay Time: 20ns; Turn-On Delay Time: 20ns; Gate to Source Voltage (Vgs): 20V; Element Configuration: Single; Voltage Rating (DC): 50V; Current Rating: 200mA; Voltage: 50V; On-State Resistance: 3.5R; Polarity: N-CHANNEL; Drain-source On Resistance-Max: 3.5R; Dual Supply Voltage: 50V; Termination: SMD/SMT; RoHS Compliant: Yes; Reach SVHC Compliant: Yes; Lead Free: Lead Free
R2 R4-R9 = CMP-1659-00013-4: Chip Resistor, 10 KOhm, +/- 1%, 0.125 W, -55 to 155 degC, 0805 (2012 Metric), RoHS, Tape and Reel; Manufacturer: Yageo; Manufacturer Part Number: RC0805FR-0710KL; Voltage Rating: 150 V; Value: 10kR; Power Rating: 125mW; Temperature Coefficient: 100ppm/°C; Mount: Surface Mount; ComponentLink1Description: Manufacturer URL; ComponentLink2URL: http://www.yageo.com/documents/recent/PYu-RC_Group_51_RoHS_L_04.pdf; Pins: 2; Length: 2 mm; Min Operating Temperature: -55 degC; Height: 0.5 mm; Mounting Technology: Surface Mount; RoHSCompliant: true; REACH SVHC: No SVHC; ComponentLink1URL: http://www.yageo.com/; Max Operating Temperature: 155 degC; PackageReference: 0805; DatasheetVersion: Rev. 4, 02/2016; Package Quantity: 5000; Packaging: Tape and Reel; ComponentLink2Description: Datasheet; PackageDescription: 2-Pin Surface Mounted Device, Body 2 x 1.25 mm; Supplier 1: Digi-Key; Supplier Part Number 1: 311-10.0KCRCT-ND; RoHS: Yes; Category: Chip SMD Resistors; Stock 1: 11227289; Pricing 1: 1=0.10000, 10=0.03300, 100=0.01340, 1000=0.00602, 2500=0.00523 (USD); Case/Package: 0805; Case Code (Imperial): 0805; Case Code (Metric): 2012; Tolerance: 1%; Termination: SMD/SMT; Series: RC; Resistance Tolerance: 1%; Resistor Type: Thick Film; Number of Terminations: 2; Max Power Dissipation: 125mW; Construction: Rectangular; Technology: THICK FILM; Features: Moisture Resistant; Width: 0.049inch; Depth: 1.25mm; Lead Free: Lead Free; RoHS Compliant: Yes; Military Standard: Not
R65 = CMP-2001-03823-2: as R12 on sheet MotorDrivers; Mount: Surface Mount; Packaging: Tape and Reel; Min Operating Temperature: -55°C; Military Standard: Not; Case Code (Metric): 2012; Height: 0.02inch; Voltage Rating: 150V; Case/Package: 0805; Max Operating Temperature: 155°C; Width: 0.049inch; Case Code (Imperial): 0805; Termination: SMD/SMT; Lead Free: Lead Free; Contact Plating: Tin; Package Quantity: 10; Composition: Thick Film; Length: 2mm; Features: Automotive AEC-Q200; Depth: 1.25mm; Weight: 0.000194oz; Tolerance: 1%; Power Rating: 125mW; Number of Terminations: 2; Temperature Coefficient: 100ppm/°C; Supplier 1: Digi-Key; Supplier Part Number 1: 541-330CCT-ND; RoHS: Yes; Category: Chip SMD Resistors; Stock 1: 1889; Pricing 1: 1=0.10000, 10=0.06700, 100=0.02710, 1000=0.01219, 2500=0.01058 (USD); Size Code: 0805; Series: CRCW; Resistor Type: Thick Film; Construction: Rectangular; Resistance Tolerance: 1%; Ratings: AEC-Q200; RoHS Compliant: Yes; ComponentLink1URL: https://datasheet.ciiva.com/8944/dcrcwe3-8944773.pdf?src-supplier=Avnet; ComponentLink1Description: https://datasheet.ciiva.com/8944/dcrcwe3-8944773.pdf?src-supplier=Avnet; ComponentLink2URL: https://datasheet.ciiva.com/8944/dcrcwe3-8944776.pdf?src-supplier=Avnet; ComponentLink2Description: https://datasheet.ciiva.com/8944/dcrcwe3-8944776.pdf?src-supplier=Avnet; ComponentLink3URL: https://datasheet.ciiva.com/2495/dcrcwe3-2495803.pdf?src-supplier=Digi-Key; ComponentLink3Description: https://datasheet.ciiva.com/2495/dcrcwe3-2495803.pdf?src-supplier=Digi-Key; ComponentLink4URL: https://datasheet.ciiva.com/2495/dcrcwe3-2495804.pdf?src-supplier=Digi-Key; ComponentLink4Description: https://datasheet.ciiva.com/2495/dcrcwe3-2495804.pdf?src-supplier=Digi-Key; ComponentLink5URL: https://datasheet.ciiva.com/2495/dcrcwe3-2495805.pdf?src-supplier=Digi-Key; ComponentLink5Description: https://datasheet.ciiva.com/2495/dcrcwe3-2495805.pdf?src-supplier=Digi-Key; ComponentLink6URL: https://datasheet.ciiva.com/5545/dcrcwe3-109170-5545357.pdf?src-supplier=Mouser; ComponentLink6Description: https://datasheet.ciiva.com/5545/dcrcwe3-109170-5545357.pdf?src-supplier=Mouser; ComponentLink7URL: https://datasheet.ciiva.com/16769/70201119-16769852.pdf?src-supplier=Allied+Electronics; ComponentLink7Description: https://datasheet.ciiva.com/16769/70201119-16769852.pdf?src-supplier=Allied+Electronics; ComponentLink8URL: https://datasheet.ciiva.com/7777/1697337-7777390.pdf?src-supplier=Element14; ComponentLink8Description: https://datasheet.ciiva.com/7777/1697337-7777390.pdf?src-supplier=Element14; ComponentLink9URL: https://datasheet.ciiva.com/7777/1720486-7777573.pdf?src-supplier=Element14; ComponentLink9Description: https://datasheet.ciiva.com/7777/1720486-7777573.pdf?src-supplier=Element14
TP9-TP22 TP68 = CMP-1672-00008-1: as TP1 on sheet MotorDrivers; ComponentLink1Description: Manufacturer URL; Package Quantity: 1000; DatasheetVersion: 03/2014; Packaging: Tape and Reel; ComponentLink2URL: http://www.keyelco.com/product-pdf.cfm?p=1357; ComponentLink1URL: http://www.keyelco.com/; Mount: Surface Mount; Contact Plating: Silver; PackageDescription: 1-Pin Surface Mount Device, Body 3.81 x 2.03 mm; Pins: 1; RoHSCompliant: True; Mounting Technology: Surface Mount; ComponentLink2Description: Datasheet; PackageReference: 5019; Supplier 1: Digi-Key; Supplier Part Number 1: 36-5019CT-ND; Manufacturer Part Number: 5019; RoHS: Yes; Category: Connectors; Stock 1: 1009631; Pricing 1: 1=0.34000, 25=0.27360, 100=0.22340, 250=0.20064, 500=0.19152 (USD); Number of Pins: 1; Material: Bronze; Contact Material: Bronze; Series: 5019; Termination: SMD/SMT; Height: 0.09inch; RoHS Compliant: Yes; Reach SVHC Compliant: Yes; Lead Free: Lead Free; ComponentLink3URL: https://datasheet.ciiva.com/16885/70182998-16885945.pdf?src-supplier=Allied+Electronics; ComponentLink3Description: https://datasheet.ciiva.com/16885/70182998-16885945.pdf?src-supplier=Allied+Electronics; ComponentLink4URL: https://datasheet.ciiva.com/14848/m60-2p61-14848437.pdf?src-supplier=Digi-Key; ComponentLink4Description: https://datasheet.ciiva.com/14848/m60-2p61-14848437.pdf?src-supplier=Digi-Key; ComponentLink5URL: https://datasheet.ciiva.com/14848/m60-2p61-14848438.pdf?src-supplier=Digi-Key; ComponentLink5Description: https://datasheet.ciiva.com/14848/m60-2p61-14848438.pdf?src-supplier=Digi-Key; ComponentLink6URL: https://datasheet.ciiva.com/14848/m60-2p61-14848439.pdf?src-supplier=Digi-Key; ComponentLink6Description: https://datasheet.ciiva.com/14848/m60-2p61-14848439.pdf?src-supplier=Digi-Key; ComponentLink7URL: https://datasheet.ciiva.com/16318/m60-2p61-16318395.pdf?src-supplier=Future+Electronics; ComponentLink7Description: https://datasheet.ciiva.com/16318/m60-2p61-16318395.pdf?src-supplier=Future+Electronics

## Sheet PowerDistribution.SchDoc
size B; SheetNumber: 4; SheetTotal: 11
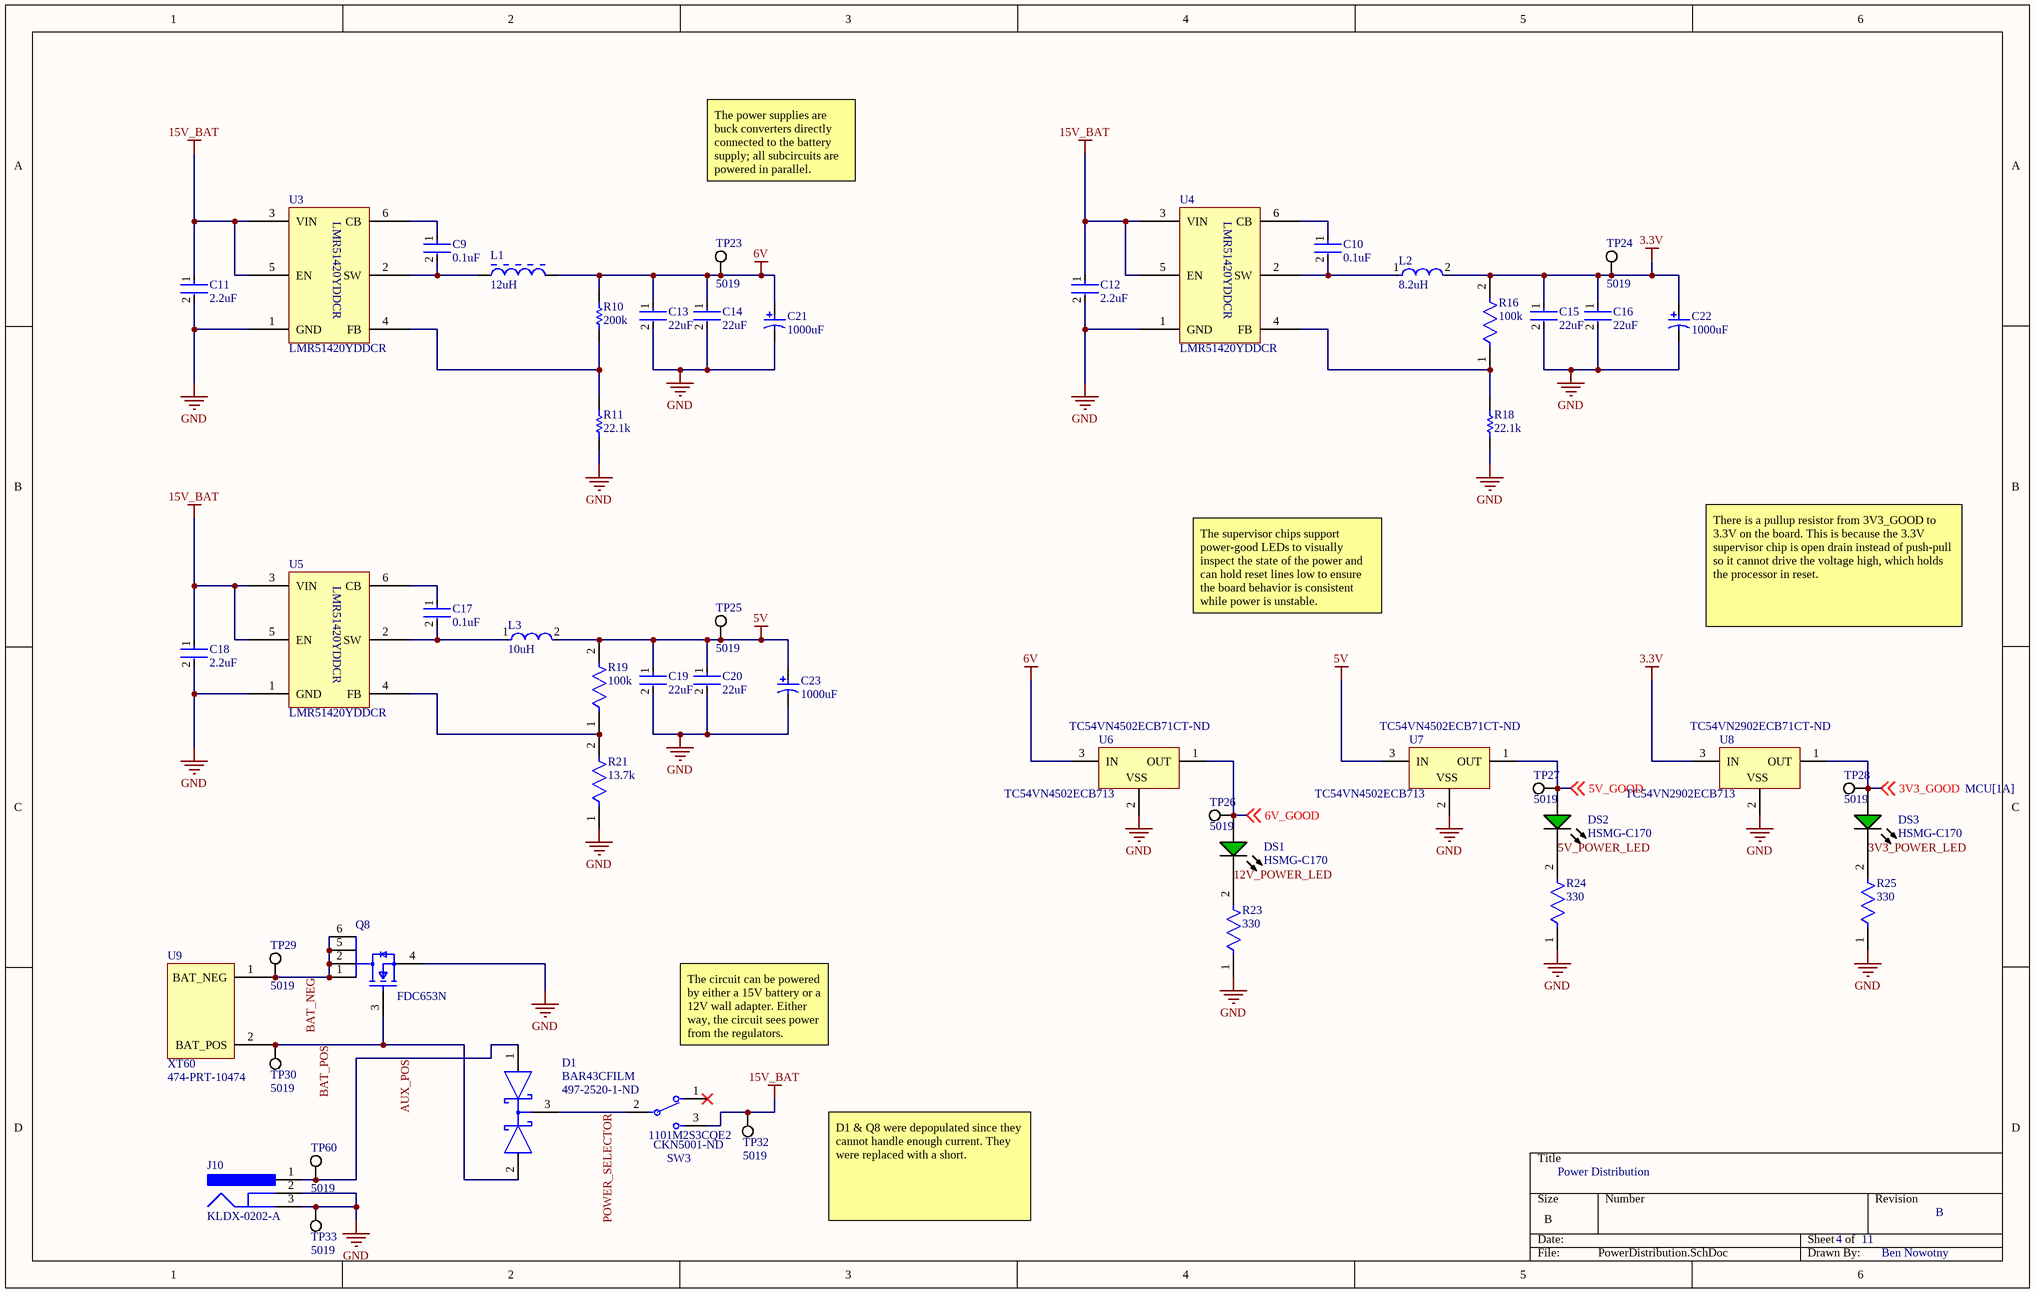
[diagram p3: PowerDistribution.SchDoc]

### Parts
C9  0.1uF  [FP-CC0805-0_85-MFG]
C10  0.1uF  [FP-CC0805-0_85-MFG]
C11  2.2uF  [FP-CGA4J-IPC_A]
C12  2.2uF  [FP-CGA4J-IPC_A]
C13  22uF  [FP-GRM21B-0_2-e0_2_0_7-IPC_B]
C14  22uF  [FP-GRM21B-0_2-e0_2_0_7-IPC_B]
C15  22uF  [FP-GRM21B-0_2-e0_2_0_7-IPC_B]
C16  22uF  [FP-GRM21B-0_2-e0_2_0_7-IPC_B]
C17  0.1uF  [FP-CC0805-0_85-MFG]
C18  2.2uF  [FP-CGA4J-IPC_A]
C19  22uF  [FP-GRM21B-0_2-e0_2_0_7-IPC_B]
C20  22uF  [FP-GRM21B-0_2-e0_2_0_7-IPC_B]
C21  1000uF  [NIC-CAPA2-10X10_V]
C22  1000uF  [NIC-CAPA2-10X10_V]
C23  1000uF  [NIC-CAPA2-10X10_V]
D1  BAR43CFILM  Supplier Part Number 1: 497-2520-1-ND  [FP-SOT23-3L-MFG]
DS1  HSMG-C170  [AVAG-HSMX-C170_V]
DS2  HSMG-C170  [AVAG-HSMX-C170_V]
DS3  HSMG-C170  [AVAG-HSMX-C170_V]
J10  KLDX-0202-A  [KYCN-KLDX-0202-A_V]
L1  12uH  [BOUR-SDR0403-2_V]
L2  8.2uH  [FP-SRP4020TA-MFG]
L3  10uH  [FP-LB2012-1_25-0_2-MFG]
Q8  FDC653N  [FP-419BL-MFG]
R10  200k  [RESC2013X50X30NL20T20]
R11  22.1k  [RESC2013X70X40NL20T20]
R16  100k  [FP-RC0805-0_6-IPC_C]
R18  22.1k  [RESC2013X70X40NL20T20]
R19  100k  [FP-RC0805-0_6-IPC_C]
R21  13.7k  [FP-CRCW0805-e3-IPC_A]
R23  330  [FP-CRCW0805-e3-MFG]
R24  330  [FP-CRCW0805-e3-MFG]
R25  330  [FP-CRCW0805-e3-MFG]
SW3  1101M2S3CQE2  Supplier Part Number 1: CKN5001-ND  [FP-1101M2S3CQE2-MFG]
TP23  5019  [KSTN-5019_V]
TP24  5019  [KSTN-5019_V]
TP25  5019  [KSTN-5019_V]
TP26  5019  [KSTN-5019_V]
TP27  5019  [KSTN-5019_V]
TP28  5019  [KSTN-5019_V]
TP29  5019  [KSTN-5019_V]
TP30  5019  [KSTN-5019_V]
TP32  5019  [KSTN-5019_V]
TP33  5019  [KSTN-5019_V]
TP60  5019  [KSTN-5019_V]
U3  LMR51420YDDCR  [BUCK_REG_FOOTPRINT_SOT95P280X110-6N]
U4  LMR51420YDDCR  [BUCK_REG_FOOTPRINT_SOT95P280X110-6N]
U5  LMR51420YDDCR  [BUCK_REG_FOOTPRINT_SOT95P280X110-6N]
U6  TC54VN4502ECB713  Supplier Part Number 1: TC54VN4502ECB71CT-ND  [SOT-23A-CB3_L]
U7  TC54VN4502ECB713  Supplier Part Number 1: TC54VN4502ECB71CT-ND  [SOT-23A-CB3_L]
U8  TC54VN2902ECB713  Supplier Part Number 1: TC54VN2902ECB71CT-ND  [SOT-23A-CB3_L]
U9  XT60  Supplier Part Number 1: 474-PRT-10474  [XT60]

### Nets
3.3V: C15.1 C16.1 C22.1 L2.2 R16.2 TP24.1 U8.3(IN)  [project net RGBLED_R]
5V: C19.1 C20.1 C23.1 L3.2 R19.2 TP25.1 U7.3(IN)
6V: C13.1 C14.1 C21.1 L1.2 R10.2 TP23.1 U6.3(IN)
15V_BAT: C11.1 C12.1 C18.1 SW3.3 TP32.1 U3.3(VIN) U3.5(EN) U4.3(VIN) U4.5(EN) U5.3(VIN) U5.5(EN)
GND: C11.2 C12.2 C13.2 C14.2 C15.2 C16.2 C18.2 C19.2 C20.2 C21.2 C22.2 C23.2 J10.2 J10.3 Q8.4(S) R11.1 R18.1 R21.1 R23.1 R24.1 R25.1 TP33.1 U3.1(GND) U4.1(GND) U5.1(GND) U6.2(VSS) U7.2(VSS) U8.2(VSS)
3V3_GOOD: DS3.1(A) TP28.1 U8.1(OUT) ; off-sheet 3V3_GOOD
3V3_POWER_LED: DS3.2(K) R25.2
5V_GOOD: DS2.1(A) TP27.1 U7.1(OUT) ; off-sheet 5V_GOOD
5V_POWER_LED: DS2.2(K) R24.2
6V_GOOD: DS1.1(A) TP26.1 U6.1(OUT) ; off-sheet 6V_GOOD
12V_POWER_LED: DS1.2(K) R23.2
AUX_POS: D1.1(A1) J10.1 TP60.1
BAT_NEG: Q8.1(D) Q8.2(D) Q8.5(D) Q8.6(D) TP29.1 U9.1(BAT_NEG)
BAT_POS: D1.2(A2) Q8.3(G) TP30.1 U9.2(BAT_POS)
POWER_SELECTOR: D1.3(K) SW3.2(COMM)
NetC9_1: C9.1 U3.6(CB)
NetC9_2: C9.2 L1.1 U3.2(SW)
NetC10_1: C10.1 U4.6(CB)
NetC10_2: C10.2 L2.1 U4.2(SW)
NetC17_1: C17.1 U5.6(CB)
NetC17_2: C17.2 L3.1 U5.2(SW)
NetR10_1: R10.1 R11.2 U3.4(FB)
NetR16_1: R16.1 R18.2 U4.4(FB)
NetR19_1: R19.1 R21.2 U5.4(FB)

Not connected (* = marked no-connect by the designer): SW3 1*

### Notes on the sheet
- The power supplies are buck converters directly connected to the battery supply; all subcircuits are powered in parallel.
- The supervisor chips support power-good LEDs to visually inspect the state of the power and can hold reset lines low to ensure the board behavior is consistent while power is unstable.
- There is a pullup resistor from 3V3_GOOD to 3.3V on the board. This is because the 3.3V supervisor chip is open drain instead of push-pull so it cannot drive the voltage high, which holds the processor in reset.
- The circuit can be powered by either a 15V battery or a 12V wall adapter. Either way, the circuit sees power from the regulators.
- Power Distribution
- D1 & Q8 were depopulated since they cannot handle enough current. They were replaced with a short.
- 11
- B
- Ben Nowotny